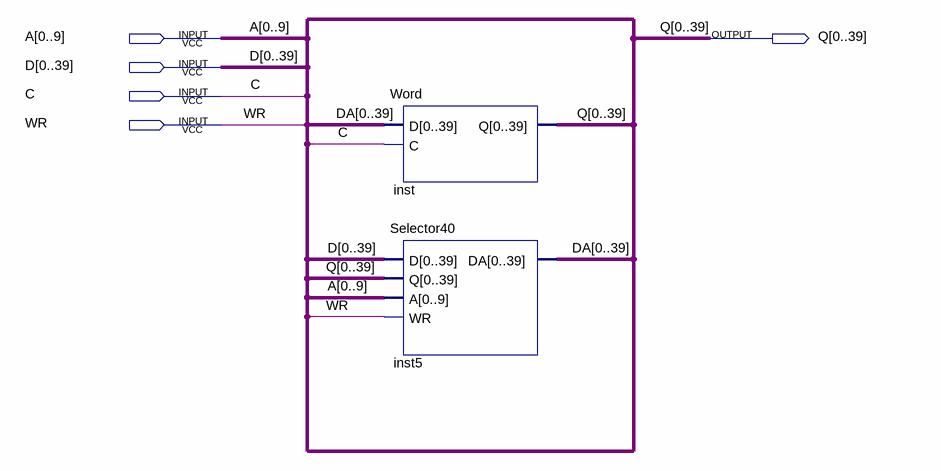
[diagram p0: schematic sheet]
// Quartus schematic WordSelector.bdf as structural Verilog: 2 symbols, 5 pins
module WordSelector (
  input  [0:9] A,
  input  [0:39] D,
  input  C,
  input  WR,
  output [0:39] Q
);

  wire [39:0] DA;

  Word inst (
    .D({DA[0], DA[1], DA[2], DA[3], DA[4], DA[5], DA[6], DA[7], DA[8], DA[9], DA[10], DA[11], DA[12], DA[13], DA[14], DA[15], DA[16], DA[17], DA[18], DA[19], DA[20], DA[21], DA[22], DA[23], DA[24], DA[25], DA[26], DA[27], DA[28], DA[29], DA[30], DA[31], DA[32], DA[33], DA[34], DA[35], DA[36], DA[37], DA[38], DA[39]}),
    .C(C), .Q(Q));
  Selector40 inst5 (
    .D(D), .Q(Q), .A(A), .WR(WR),
    .DA({DA[0], DA[1], DA[2], DA[3], DA[4], DA[5], DA[6], DA[7], DA[8], DA[9], DA[10], DA[11], DA[12], DA[13], DA[14], DA[15], DA[16], DA[17], DA[18], DA[19], DA[20], DA[21], DA[22], DA[23], DA[24], DA[25], DA[26], DA[27], DA[28], DA[29], DA[30], DA[31], DA[32], DA[33], DA[34], DA[35], DA[36], DA[37], DA[38], DA[39]}));
endmodule
